# EAGLE design Board (EAGLE 9.5.2)
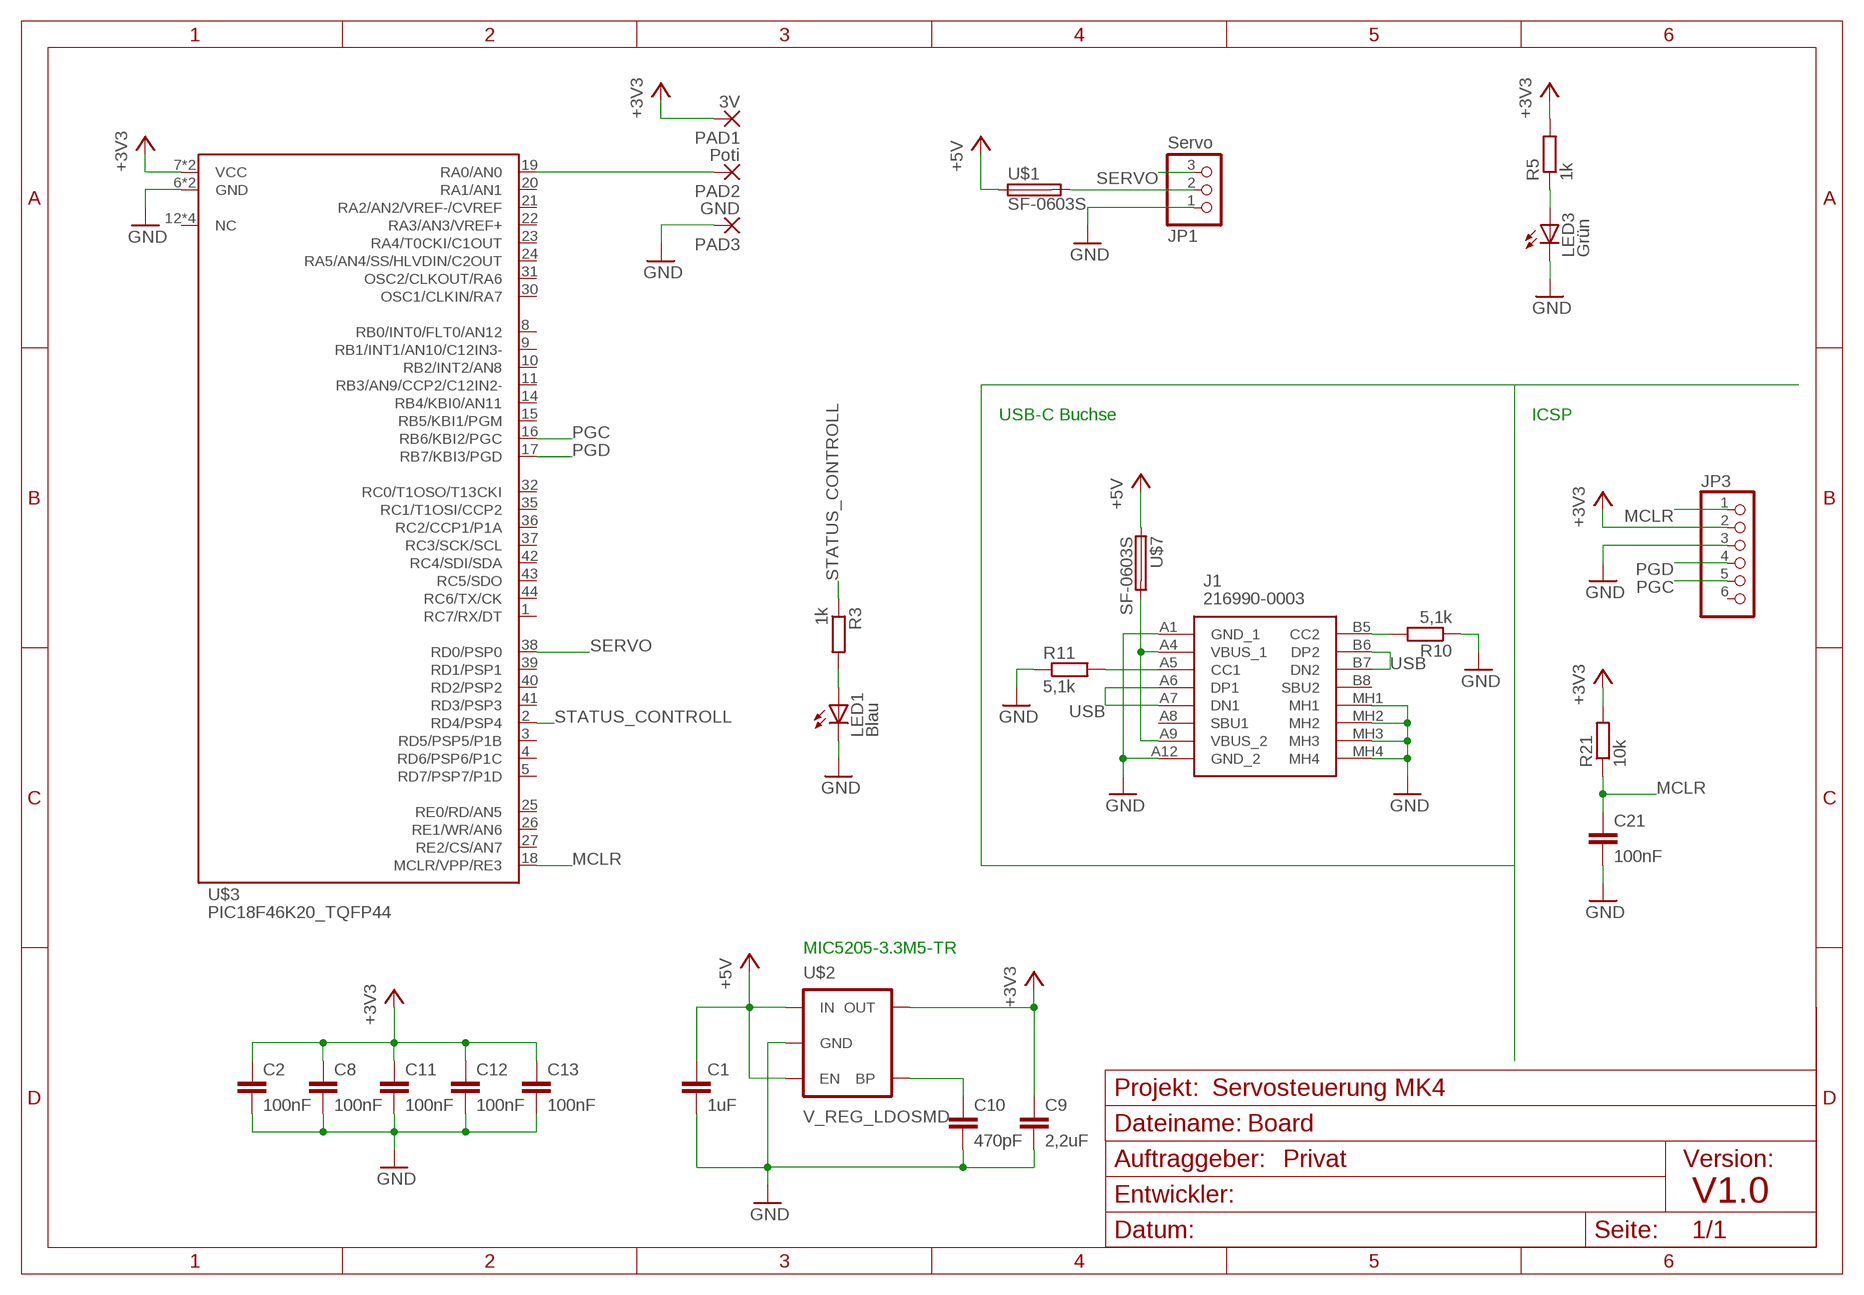
[diagram p0: schematic, sheet 1]

## Parts
C1  1uF  C-EUC0805  [C0805]
C2  100nF  C-EUC0805  [C0805]
C8  100nF  C-EUC0805  [C0805]
C9  2,2uF  C-EUC0805  [C0805]
C10  470pF  C-EUC0805  [C0805]
C11  100nF  C-EUC0805  [C0805]
C12  100nF  C-EUC0805  [C0805]
C13  100nF  C-EUC0805  [C0805]
C21  100nF  C-EUC0805  [C0805]
J1  216990-0003  [2169900003]
JP1  Servo  PINHD-1X3/90  [1X03/90]
JP3  PINHD-1X6  [1X06]
LED1  Blau  LEDCHIPLED_0805  [CHIPLED_0805]
LED3  Grün  LEDCHIPLED_0805  [CHIPLED_0805]
PAD1  3V  WIREPAD_50SMD5-1,8  [5-1,8_50]
PAD2  Poti  WIREPAD_50SMD5-1,8  [5-1,8_50]
PAD3  GND  WIREPAD_50SMD5-1,8  [5-1,8_50]
R3  1k  R-EU_R0805  [R0805]
R5  1k  R-EU_R0805  [R0805]
R10  5,1k  R-EU_R0805  [R0805]
R11  5,1k  R-EU_R0805  [R0805]
R21  10k  R-EU_R0805  [R0805]
U$1  SF-0603S  [R0603]
U$2  V_REG_LDOSMD  [SOT23-5]
U$3  PIC18F46K20_TQFP44  [TQFP44]
U$7  SF-0603S  [R0603]

## Nets
+3V3: C2.1 C8.1 C9.1 C11.1 C12.1 C13.1 JP3.2 PAD1.1(P) R5.2 R21.2 U$2.5(OUT) U$3.7(VCC) U$3.28(VCC)
+5V: C1.1 U$1.1 U$2.1(IN) U$2.3(EN) U$7.1
GND: C1.2 C2.2 C8.2 C9.2 C10.2 C11.2 C12.2 C13.2 C21.2 J1.A1(GND_1) J1.A12(GND_2) J1.MH1 J1.MH2 J1.MH3 J1.MH4 JP1.1 JP3.3 LED1.C LED3.C PAD3.1(P) R10.1 R11.1 U$2.2(GND) U$3.6(GND) U$3.29(GND)
MCLR: C21.1 JP3.1 R21.1 U$3.18(MCLR/VPP/RE3)
N$1: PAD2.1(P) U$3.19(RA0/AN0)
N$3: JP1.2 U$1.2
N$4: LED3.A R5.1
N$5: LED1.A R3.2
N$12: C10.1 U$2.4(BP)
N$18: J1.A4(VBUS_1) J1.A9(VBUS_2) U$7.2
N$19: J1.A5(CC1) R11.2
N$20: J1.B5(CC2) R10.2
PGC: JP3.5 U$3.16(RB6/KBI2/PGC)
PGD: JP3.4 U$3.17(RB7/KBI3/PGD)
SERVO: JP1.3 U$3.38(RD0/PSP0)
STATUS_CONTROLL: R3.1 U$3.2(RD4/PSP4)
USB: J1.A6(DP1) J1.A7(DN1) J1.B6(DP2) J1.B7(DN2)
Unconnected: J1.A8(SBU1) J1.B8(SBU2) JP3.6 U$3.1(RC7/RX/DT) U$3.3(RD5/PSP5/P1B) U$3.4(RD6/PSP6/P1C) U$3.5(RD7/PSP7/P1D) U$3.8(RB0/INT0/FLT0/AN12) U$3.9(RB1/INT1/AN10/C12IN3-) U$3.10(RB2/INT2/AN8) U$3.11(RB3/AN9/CCP2/C12IN2-) U$3.12(NC) U$3.13(NC) U$3.14(RB4/KBI0/AN11) U$3.15(RB5/KBI1/PGM) U$3.20(RA1/AN1) U$3.21(RA2/AN2/VREF-/CVREF) U$3.22(RA3/AN3/VREF+) U$3.23(RA4/T0CKI/C1OUT) U$3.24(RA5/AN4/SS/HLVDIN/C2OUT) U$3.25(RE0/RD/AN5) U$3.26(RE1/WR/AN6) U$3.27(RE2/CS/AN7) U$3.30(OSC1/CLKIN/RA7) U$3.31(OSC2/CLKOUT/RA6) U$3.32(RC0/T1OSO/T13CKI) U$3.33(NC) U$3.34(NC) U$3.35(RC1/T1OSI/CCP2) U$3.36(RC2/CCP1/P1A) U$3.37(RC3/SCK/SCL) U$3.39(RD1/PSP1) U$3.40(RD2/PSP2) U$3.41(RD3/PSP3) U$3.42(RC4/SDI/SDA) U$3.43(RC5/SDO) U$3.44(RC6/TX/CK)

## Notes on the sheet
- USB-C Buchse | ICSP
- MIC5205-3.3M5-TR
- Servosteuerung MK4
- Privat
- V1.0

## Library data of the parts
C1 C2 C8-C13 C21 = rcl:C-EU: CAPACITOR, European symbol; SPICEPREFIX: C
J1 = 216990-0003:216990-0003: USB Connectors Mid-Mnt SMT CH0.58 16Ckt Type C Rec. Source: Datasheet <https://www.molex.com/pdm_docs/sd/2169900003_sd.pdf>; DESCRIPTION: USB Connectors Mid-Mnt SMT CH0.58 16Ckt Type C Rec.; HEIGHT: 3.36mm; MANUFACTURER_NAME: Molex; MANUFACTURER_PART_NUMBER: 216990-0003; MOUSER_PART_NUMBER: 538-216990-0003; MOUSER_PRICE-STOCK: https://www.mouser.co.uk/ProductDetail/Molex/216990-0003?qs=DRkmTr78QASn0GILUGAYCA%3D%3D
JP1 = pinhead:PINHD-1X3: PIN HEADER
JP3 = pinhead:PINHD-1X6: PIN HEADER
LED1 LED3 = led:LED: LED OSRAM: - CHIPLED LG R971, LG N971, LY N971, LG Q971, LY Q971, LO R971, LY R971 LH N974, LH R974 LS Q976, LO Q976, LY Q976 LO Q996 - Hyper CHIPLED LW Q18S LB Q993, LB Q99A, LB R99A - SideLED LS A670, LO A670, LY A670, LG A670, LP A670 LB A673, LV A673, LT A673, LW A673 LH A674 LY A675 LS A676, LA A676, LO A676, LY A676, LW A676 LS A679, LY A679, LG A679 - Hyper Micro SIDELED® LS Y876, LA Y876, LO Y876, LY Y876 LT Y87S - SmartLED LW L88C, LW L88S LB L89C, LB L89S, LG L890 LS L89K, LO L89K, LY L89K LS L896, LA L896, LO L896, LY L896 - TOPLED LS T670, LO T670, LY T670, LG T670, LP T670 LSG T670, LSP T670, LSY T670, LOP T670, LYG T670 LG T671, LOG T671, LSG T671 LB T673, LV T673, LT T673, LW T673 LH T674 LS T676, LA T676, LO T676, LY T676, LB T676, LH T676, LSB T676, LW T676 LB T67C, LV T67C, LT T67C, LS T67K, LO T67K, LY T67K, LW E67C LS E67B, LA E67B, LO E67B, LY E67B, LB E67C, LV E67C, LT E67C LW T67C LS T679, LY T679, LG T679 LS T770, LO T770, LY T770, LG T770, LP T770 LB T773, LV T773, LT T773, LW T773 LH T774 LS E675, LA E675, LY E675, LS T675 LS T776, LA T776, LO T776, LY T776, LB T776 LHGB T686 LT T68C, LB T68C - Hyper Mini TOPLED® LB M676 - Mini TOPLED Santana® LG M470 LS M47K, LO M47K, LY M47K Source: http://www.osram.convergy.de LUXEON: - LUMILED® LXK2-PW12-R00, LXK2-PW12-S00, LXK2-PW14-U00, LXK2-PW14-V00 LXK2-PM12-R00, LXK2-PM12-S00, LXK2-PM14-U00 LXK2-PE12-Q00, LXK2-PE12-R00, LXK2-PE12-S00, LXK2-PE14-T00, LXK2-PE14-U00 LXK2-PB12-K00, LXK2-PB12-L00, LXK2-PB12-M00, LXK2-PB14-N00, LXK2-PB14-P00, LXK2-PB14-Q00 LXK2-PR12-L00, LXK2-PR12-M00, LXK2-PR14-Q00, LXK2-PR14-R00 LXK2-PD12-Q00, LXK2-PD12-R00, LXK2-PD12-S00 LXK2-PH12-R00, LXK2-PH12-S00 LXK2-PL12-P00, LXK2-PL12-Q00, LXK2-PL12-R00 Source: www.luxeon.com KINGBRIGHT: KA-3528ASYC Source: www.kingbright.com
PAD1-PAD3 = wirepad_50:WIREPAD_50: Wire PAD connect wire on PCB
R3 R5 R10 R11 R21 = rcl:R-EU_: RESISTOR, European symbol; SPICEPREFIX: R
U$1 U$7 = Eigene Library:SF-0603S; FARNELL: 1652144
U$2 = SparkFun:V_REG_LDO: Voltage Regulator LDO Standard 150mA LDO voltage regulator in SOT-23 layout. Micrel part MIC5205. BP (by-pass) pin is used to lower output noise with 470pF cap.
U$3 = Eigene Library:PIC18F46K20_TQFP44: Farnell: 143-9591

## Board
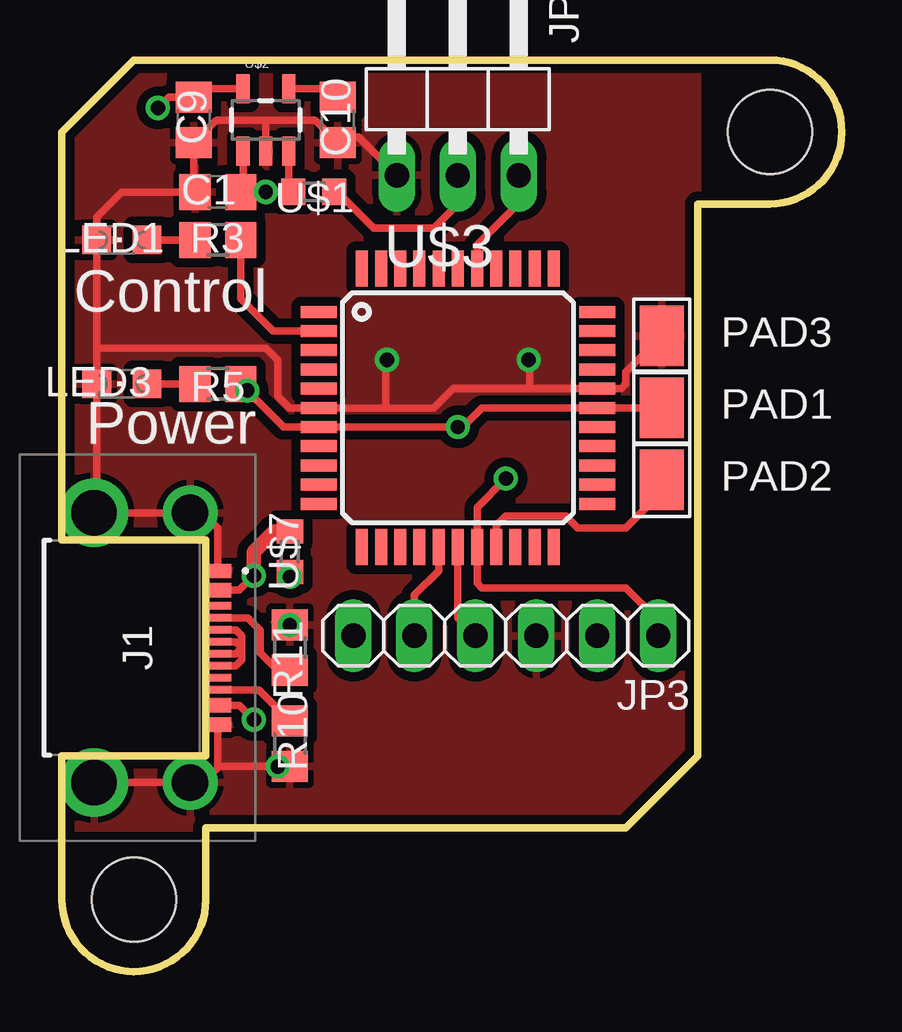
[diagram p1: board, top side]
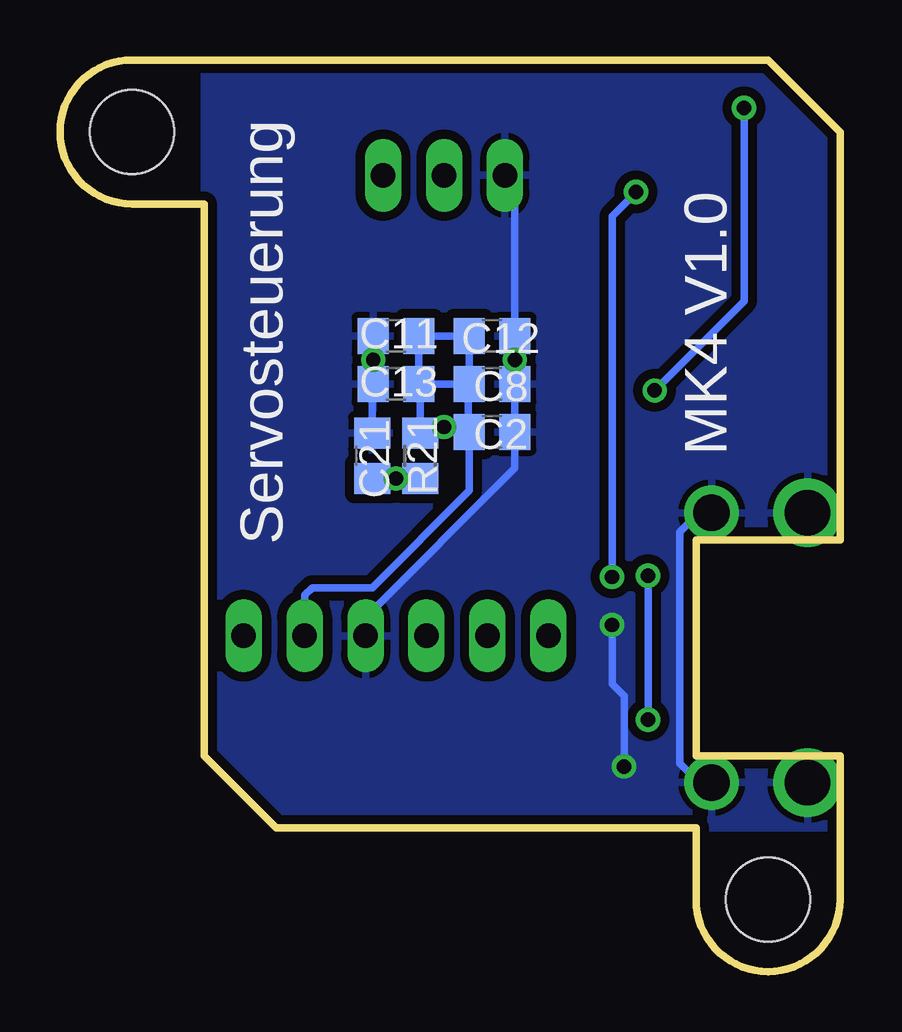
[diagram p2: board, bottom side, seen from below]

Size 32.5 x 38 mm. Coordinates in mm from the lower left corner, seen from the top.
Outline: 6,6 23.5,6 26.5,9 26.5,32 29.5,32 arc90 32.5,35 arc90 29.5,38 3,38 0,35 0,18 6,18 6,9 0,9 0,3 arc90 3,0 arc90 6,3 6,6
Copper layers (1*16): Top 0.035mm / dielectric 1.5mm / Bottom 0.035mm
Design rules "Torben": minimum track width 12mil, minimum drill 0.6mm, track to track 15mil, track to pad 8mil, pad to pad 6mil, via to via 6mil, smd to smd 6mil, copper to edge 15mil, drill to drill 6mil, minimum pad ring 10mil, minimum via ring 8mil, stop-mask expansion 4mil, vias tented up to drill 0mil, thermal gap 10mil
Holes 3.5 mm at 29.5,35 3,3

### Footprints (pad centres in the part's own frame; a part is rotated, then mirrored left to right if it is on the bottom)
C0805 = smd 1.3 x 1.5: 1 -0.95,0; 2 0.95,0
2169900003 = smd 0.6 x 1.1: A1 -3.2,4; A4 -2.4,4; A9 2.4,4; A12 3.2,4 | smd 0.3 x 1.1: A5 -1.25,4; A6 -0.25,4; A7 0.25,4; A8 1.25,4; B5 1.75,4; B6 0.75,4; B7 -0.75,4; B8 -1.75,4 | drill 1.52 pad 2.28: MH1 -5.62,2.85; MH4 5.62,2.85 | drill 1.9 pad 2.85: MH2 -5.62,-1.15; MH3 5.62,-1.15
1X03/90 = drill 1.016 long: 1 -2.54,-3.81; 2 0,-3.81; 3 2.54,-3.81
1X06 = drill 1.016 long: 1 -6.35,0; 2 -3.81,0; 3 -1.27,0; 4 1.27,0; 5 3.81,0; 6 6.35,0
CHIPLED_0805 = smd 1.2 x 1.2: A 0,-1.05; C 0,1.05
5-1,8_50 = smd 1.829 x 2.54: 1 0,0
R0805 = smd 1.3 x 1.5: 1 -0.95,0; 2 0.95,0
R0603 = smd 1 x 1.1: 1 -0.85,0; 2 0.85,0
SOT23-5 = smd 0.55 x 1.2: 1 -0.95,-1.3; 2 0,-1.3; 3 0.95,-1.3; 4 0.95,1.3; 5 -0.95,1.3
TQFP44 = smd 1.5 x 0.5: 1 -5.8,4; 2 -5.8,3.2; 3 -5.8,2.4; 4 -5.8,1.6; 5 -5.8,0.8; 6 -5.8,0; 7 -5.8,-0.8; 8 -5.8,-1.6; 9 -5.8,-2.4; 10 -5.8,-3.2; 11 -5.8,-4; 23 5.8,-4; 24 5.8,-3.2; 25 5.8,-2.4; 26 5.8,-1.6; 27 5.8,-0.8; 28 5.8,0; 29 5.8,0.8; 30 5.8,1.6; 31 5.8,2.4; 32 5.8,3.2; 33 5.8,4 | smd 0.5 x 1.5: 12 -4,-5.8; 13 -3.2,-5.8; 14 -2.4,-5.8; 15 -1.6,-5.8; 16 -0.8,-5.8; 17 0,-5.8; 18 0.8,-5.8; 19 1.6,-5.8; 20 2.4,-5.8; 21 3.2,-5.8; 22 4,-5.8; 34 4,5.8; 35 3.2,5.8; 36 2.4,5.8; 37 1.6,5.8; 38 0.8,5.8; 39 0,5.8; 40 -0.8,5.8; 41 -1.6,5.8; 42 -2.4,5.8; 43 -3.2,5.8; 44 -4,5.8

### Placement (x,y rotation side)
C1  6.5,32.5 180 top
C2  14.5,22.5 0 bottom
C8  14.5,24.5 0 bottom
C9  5.5,35.5 270 top
C10  11.5,35.5 270 top
C11  18.5,26.5 180 bottom
C12  14.5,26.5 0 bottom
C13  18.5,24.5 180 bottom
C21  19.5,21.5 90 bottom
J1  2.5,13.5 270 top
JP1  16.5,37 0 top
JP3  18.5,14 180 top
LED1  2.5,30.5 90 top
LED3  2.5,24.5 90 top
PAD1  25,23.5 0 top
PAD2  25,20.5 0 top
PAD3  25,26.5 0 top
R3  6.5,30.5 180 top
R5  6.5,24.5 0 top
R10  9.5,9.5 90 top
R11  9.5,13.5 270 top
R21  17.5,21.5 90 bottom
U$1  10.5,32.5 0 top
U$2  8.5,35.5 0 top
U$3  16.5,23.5 0 top
U$7  9.5,17.5 90 top

### Tracks (layer width: path | path; a pad name or v marks a point on that pad's centre or on a via)
+3V3  (via drill 0.6)
  Top 0.305: U$2.5 5.85,36.8 C9.1 4.45,36.45 v4,36 | PAD1.1 U$3.28 17.5,23.5 16.7,22.7 v16.5,22.7 U$3.7 9.25,22.7 v7.72,24.23 R5.2
  Bottom 0.305: 17.5,22.5 R21.2 17.45,22.5 C2.1 | 17.5,22.5 17.5,24.45 C13.1 | C13.1 C11.1 C12.1 C8.1 15.5,24.5 | 15.5,24.5 C13.1 | C2.1 15.5,22.55 15.5,24.5 | v16.5,22.7 16.7,22.5 17.5,22.5 | C2.1 15.45,20.05 19.5,16 22,16 22.31,15.69 JP3.2 | v4,36 4,27.95 v7.72,24.23
+5V  (via drill 0.6)
  Top 0.305: U$2.1 7.55,32.6 C1.1 v8.5,32.5 9.5,32.5 | 9.5,32.5 U$1.1 | U$2.3 9.45,32.55 9.5,32.5 | 9.4,16.45 U$7.1
  Top 0.61: v9.5,16.45 U$7.1
  Bottom 0.305: v9.5,16.45 9.5,31.5 v8.5,32.5
GND  (via drill 0.6)
  Top 0.305: 11.27,34.77 10.61,35.44 10.6,35.44 10.55,35.5 8.5,35.5 | 11.27,34.77 C10.2 | 8.5,35.5 6.45,35.5 6.4,35.44 6.39,35.44 C9.2 5.5,32.55 C1.2 2.5,32.5 1.45,31.45 LED1.C 1.45,26 | U$2.2 8.5,35.5 | 13.5,23.5 U$3.6 9.5,23.5 9,24 9,25.5 8.5,26 1.45,26 | 13.5,23.5 15.5,23.5 16.3,24.3 19.5,24.3 | 19.5,24.3 U$3.29 23.3,24.3 23.5,24.5 23.5,25 PAD3.1 | v19.45,25.5 19.5,25.45 19.5,24.3 | v13.55,25.5 13.5,25.45 13.5,23.5 | JP1.1 12.38,34.77 11.27,34.77 | J1.MH3 1.5,7.88 | 1.5,7.88 J1.MH4 | J1.A12 6.5,8.5 | J1.MH4 5.88,7.88 6.5,8.5 | J1.A1 6.5,18.5 5.88,19.12 J1.MH1 J1.MH2 1.45,19.22 LED3.C 1.45,26 | 2.15,7.23 1.5,7.88 | v9,8.55 9.05,8.5 | R11.1 9.5,14.55 | v9,8.55 6.55,8.55 6.5,8.5 | v9,8.55 7.5,8.55 | R10.1 v9,8.55 | 9.4,8.55 v9,8.55 | 5.56,7.67 J1.MH4
  Bottom 0.305: C11.2 v19.45,25.5 C13.2 19.5,24.45 C21.2 | JP1.1 13.55,32.78 C12.2 v13.55,25.5 C8.2 C2.2 13.55,20.98 19.77,14.76 JP3.3 | v9,8.55 9,11.5 9.5,12 R11.1 | J1.MH4 5.88,7.88 6.69,8.69 6.69,18.31 5.88,19.12 J1.MH1
  other vias: 9.5,14.45
  pour Top: 0,18 0,35 3,38 26.5,38 26.5,30 26.5,9 23.5,6 0,6 0,9 6,9 6,18
  pour Bottom: 0,9 6,9 6,18 0,18 0,35 3,38 26.5,38 26.5,9 23.5,6 0,6
MCLR  (via drill 0.6)
  Top 0.305: v18.5,20.55 17.3,19.35 U$3.18 17.3,16.2 17.5,16 23.5,16 24.85,14.65 JP3.1
  Bottom 0.305: C21.1 v18.5,20.55 R21.1
N$1
  Top 0.305: U$3.19 18.1,18.6 18.5,19 21,19 21.5,18.5 23.5,18.5 25,20 PAD2.1
N$3
  Top 0.305: U$1.2 11.5,32.5 13,31 15.5,31 16.5,32 JP1.2
N$4
  Top 0.305: LED3.A R5.1
N$5
  Top 0.305: LED1.A R3.2
N$12
  Top 0.305: U$2.4 11.15,36.8 C10.1
N$18  (via drill 0.6)
  Top 0.305: J1.A4 7.4,15.9 v8,16.5 | v8,10.5 7.4,11.1 J1.A9
  Top 0.61: v8,16.5 8,17.5 8.85,18.35 U$7.2
  Bottom 0.305: v8,16.5 v8,10.5
N$19
  Top 0.305: R11.2 9,12.55 8.28,13.28 8.28,14.22 7.75,14.75 J1.A5
N$20
  Top 0.305: J1.B5 8.2,11.75 R10.2
PGC
  Top 0.305: U$3.16 15.7,16.7 14.69,15.69 JP3.5
PGD
  Top 0.305: JP3.4 16.5,14.73 U$3.17
SERVO
  Top 0.305: U$3.38 17.3,30.3 19.04,32.04 JP1.3
STATUS_CONTROLL
  Top 0.305: U$3.2 8.8,26.7 7.45,28.05 R3.1
USB
  Top 0.305: J1.B7 7.25,14.25 7.5,14 7.5,13.5 | 7.5,13.5 7.5,13 7.25,12.75 J1.B6 | J1.A7 7.25,13.25 7.5,13.5 | J1.A6 7.25,13.75 7.5,13.5

### Text on the board
tPlace: Control | Power
bPlace: Servosteuerung | MK4 V1.0